# Altium schematic sheet Flash_FPGA.SchDoc: FPGA QSPI FLASH
size B; CheckedBy: Jason Sullins; Author: Jordan Harris-Toovy; Revision: 0.2; SheetNumber: 21; SheetTotal: 22; Size: ANSI B
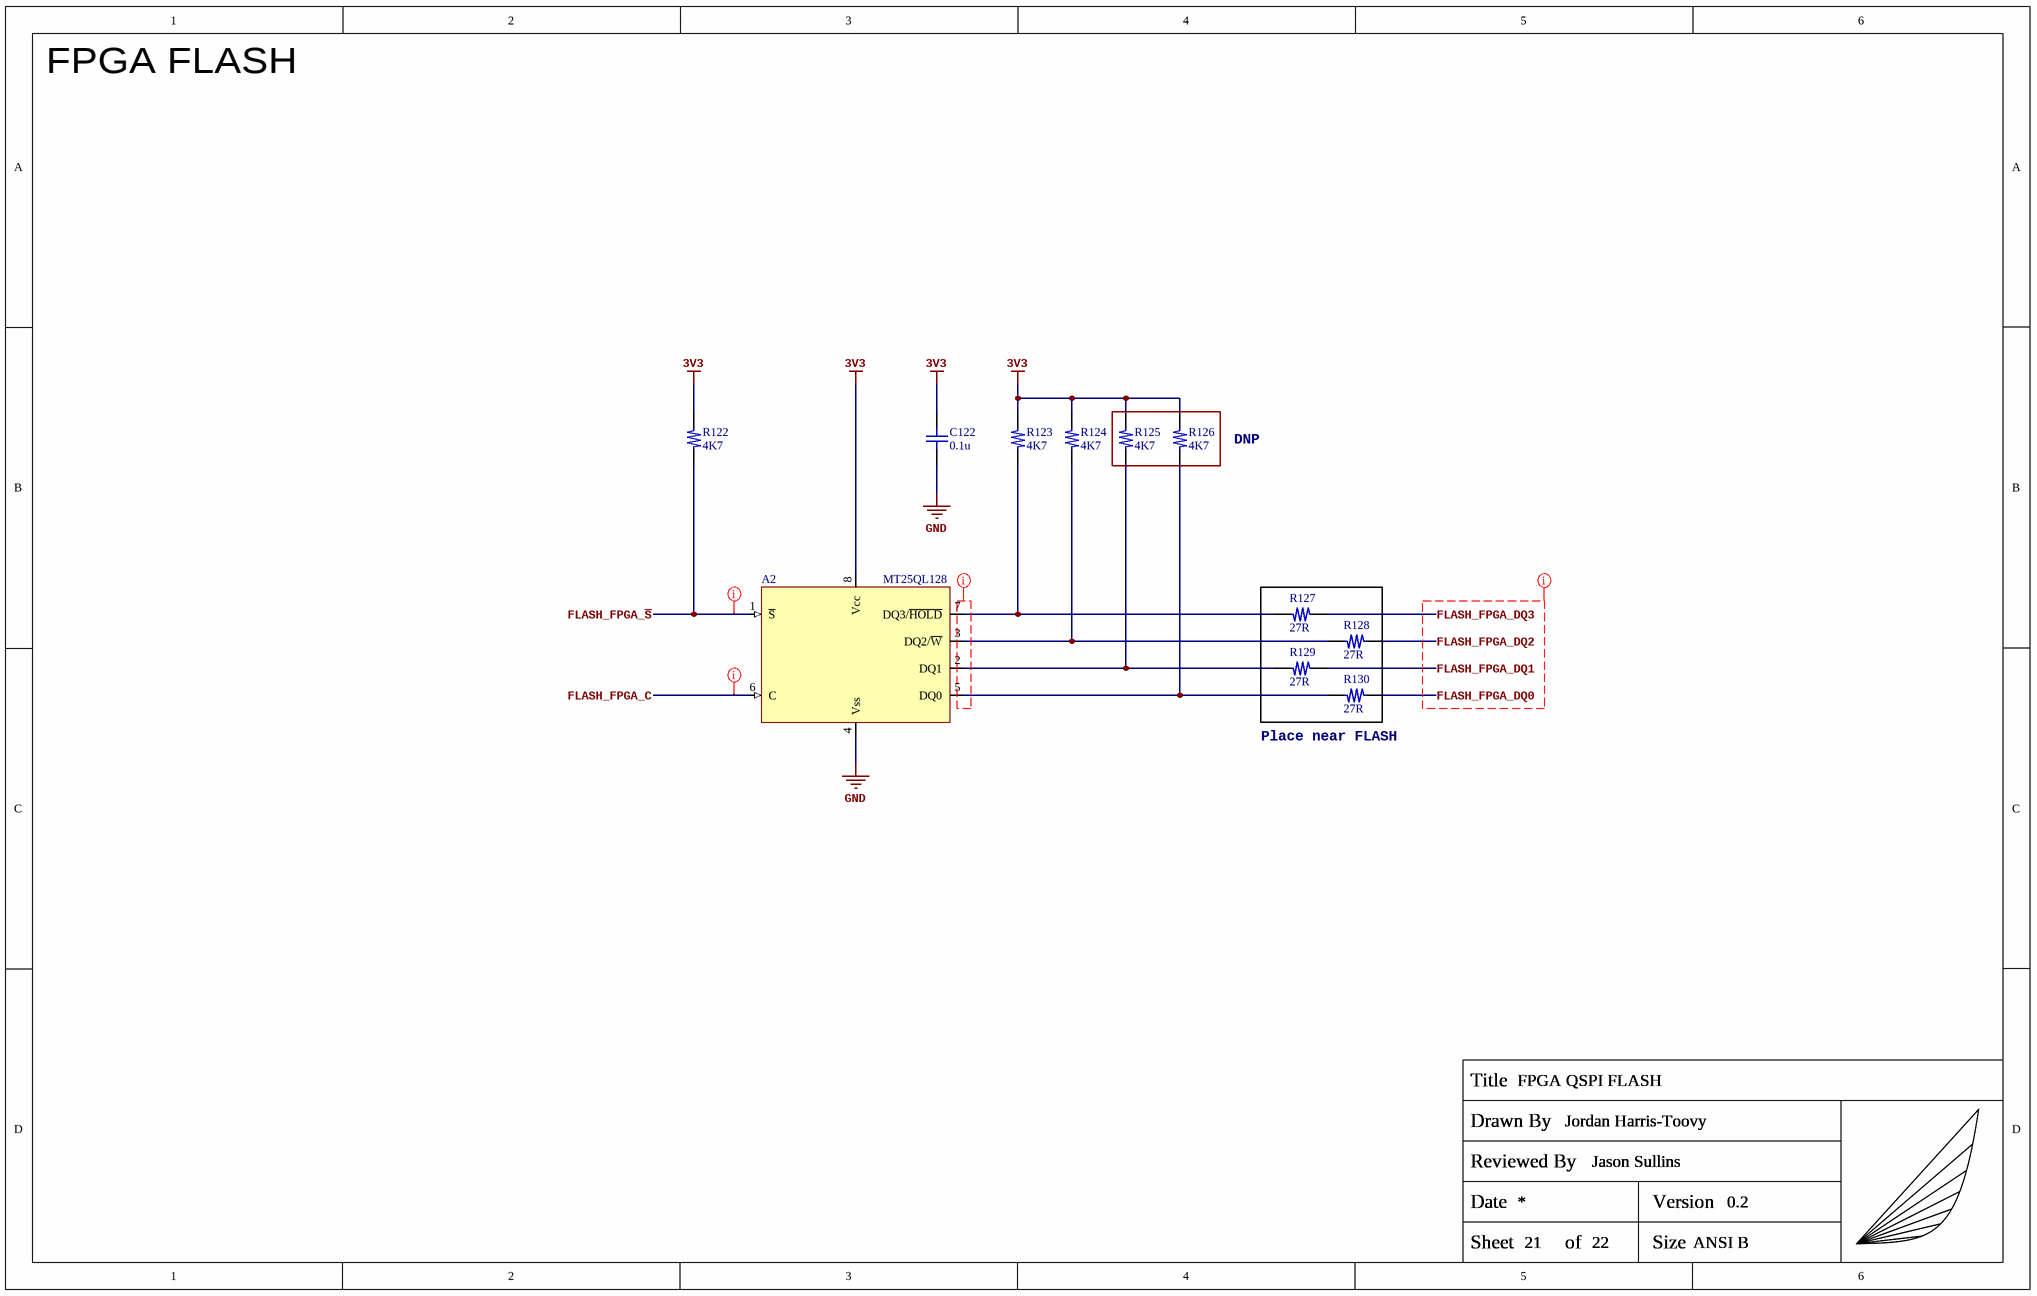
[diagram p0: Flash_FPGA.SchDoc]

## Parts
A2  MT25QL128  [LOTES_ACA-SPI-004-K01]
C122  0.1u  [C_0402_Generic]
R122  4K7  [R_0402_Generic]
R123  4K7  [R_0402_Generic]
R124  4K7  [R_0402_Generic]
R125  4K7  [R_0402_Generic]
R126  4K7  [R_0402_Generic]
R127  27R  [R_0402_Generic]
R128  27R  [R_0402_Generic]
R129  27R  [R_0402_Generic]
R130  27R  [R_0402_Generic]
TITLEBLOCK?  Capstone_Title_Block  (value not drawn)  (graphical)

## Nets
3V3: A2.8(Vcc) C122.2 R122.2 R123.2 R124.2 R125.2 R126.2
GND: A2.4(Vss) C122.1
FLASH_FPGA_C: A2.6(C)
FLASH_FPGA_DQ0: R130.1
FLASH_FPGA_DQ1: R129.1
FLASH_FPGA_DQ2: R128.1
FLASH_FPGA_DQ3: R127.1
FLASH_FPGA_~{S}: A2.1(~{S}) R122.1
NetA2_2: A2.2(DQ1) R125.1 R129.2
NetA2_3: A2.3(DQ2/~{W}) R124.1 R128.2
NetA2_5: A2.5(DQ0) R126.1 R130.2
NetA2_7: A2.7(DQ3/~{HOLD}) R123.1 R127.2

## Layout directives
net class SE50_FGPA_FLASH: FLASH_FPGA_C, FLASH_FPGA_DQ0, FLASH_FPGA_DQ1, FLASH_FPGA_DQ2, FLASH_FPGA_DQ3, FLASH_FPGA_~{S}
net class SE50_GENERAL: (no net found under the mark)

## Notes on the sheet
- FPGA FLASH
- DNP
- (near R130) Place near FLASH
- (in symbol Capstone_Title_Block) Title; Drawn By; Reviewed By; Date; Version; Sheet; of; Size

## Library data of the parts
A2 = MT25QL128ABA1ESE_ACA-SPI-004: FLASH - NOR Memory IC 128Mbit SPI (Q)SPI 133 MHz 8-SO In ACA-SPI-004-K01 socket; Manufacturer: Micron Technology Inc; Manufacturer Part Number: MT25QL128ABA1ESE; Manufacturer2: LOTES; Manufacturer2 Part Number: ACA-SPI-004-K01
C122 = GRM155R71C104KA88D: 0.1µF 16V X7R SMD ceramic capacitor in 0402 size; Manufacturer: Murata Electronics; Manufacturer Part Number: GRM155R71C104KA88D
R122-R126 = ERJ-2RKF4701X: 4.7KOhm 1% 1/10W SMD resistor in 0402 size; Manufacturer: Panasonic; Manufacturer Part Number: ERJ-2RKF4701X
R127-R130 = ERJ-2RKF27R0X: 27Ohm 1% 1/10W SMD resistor in 0402 size; Manufacturer: Panasonic; Manufacturer Part Number: ERJ-2RKF27R0X
TITLEBLOCK? = Capstone_Title_Block: Custom title block with personal logo; Manufacturer: NONE; Manufacturer Part Number: NONE